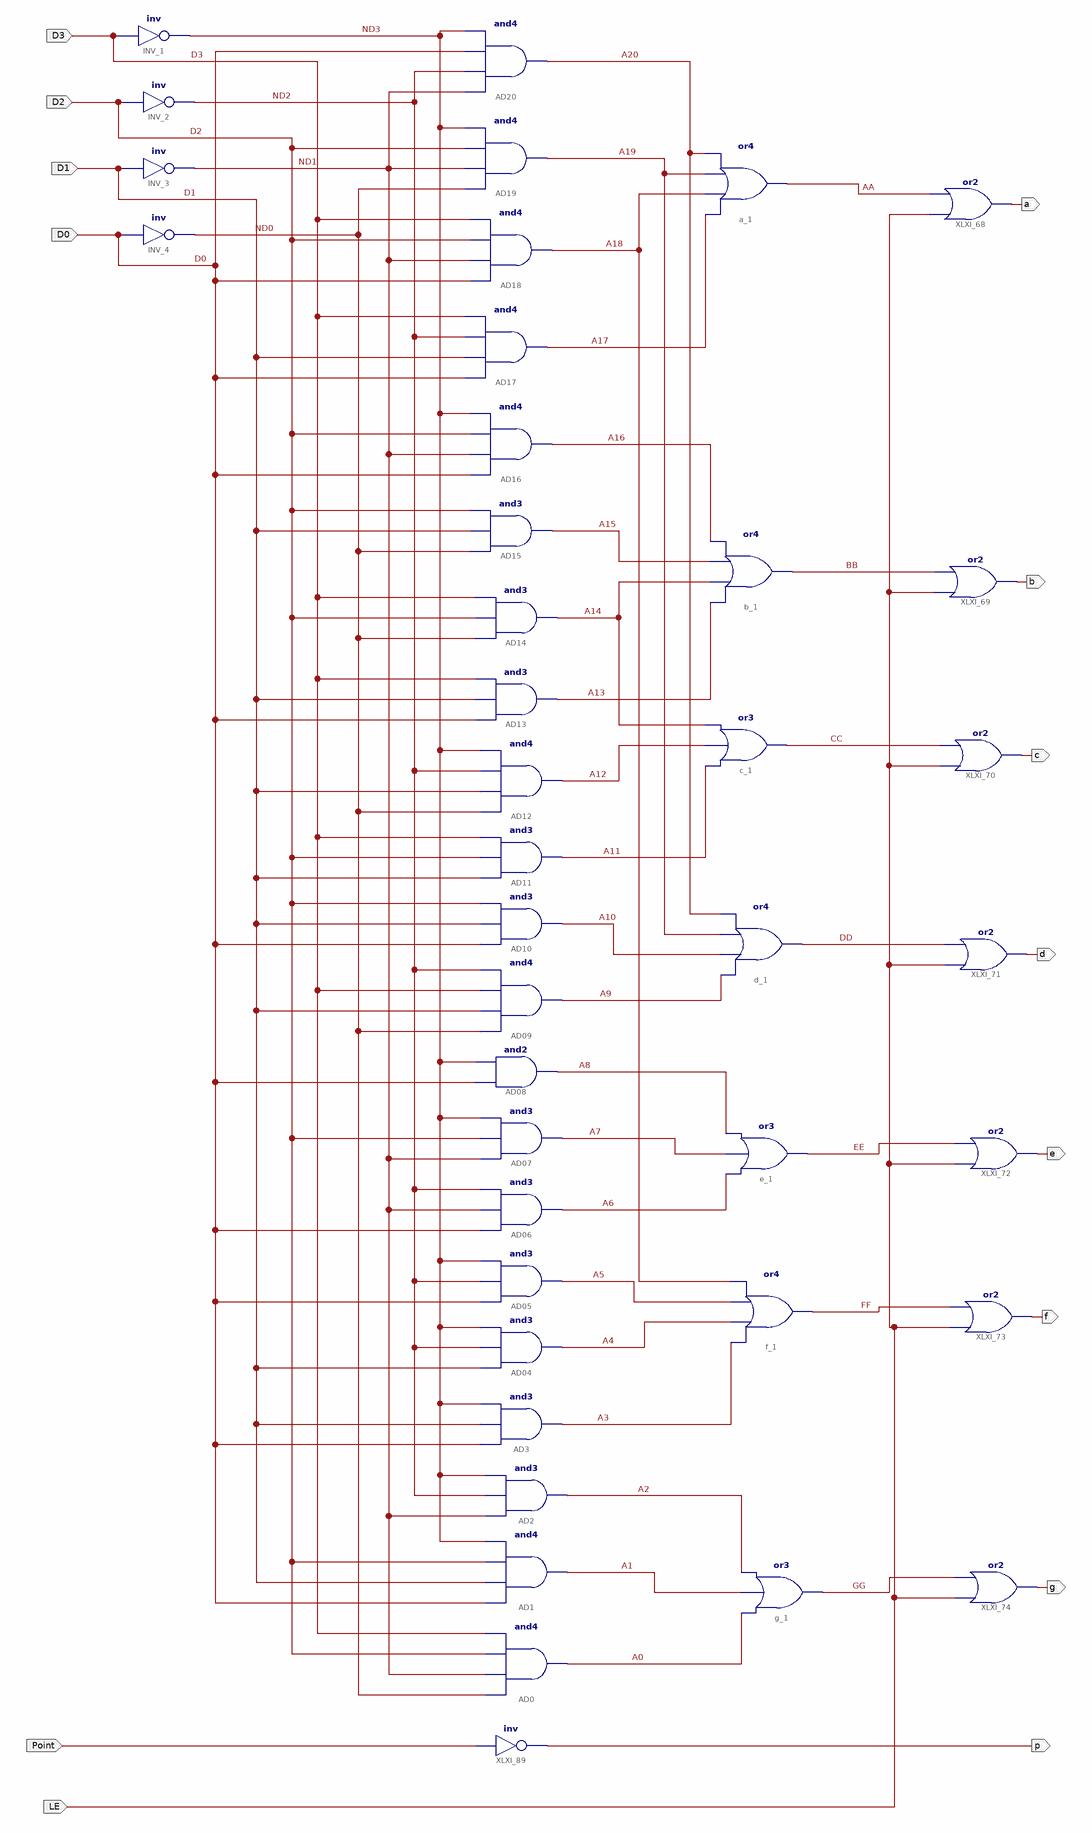
[diagram p0: schematic sheet 1]
// Xilinx ISE schematic MC14495_ZJU.sch (kintex7) as structural Verilog: 40 symbols, 14 ports
module MC14495_ZJU (
  input  D3,
  input  D2,
  input  D1,
  input  D0,
  input  Point,
  input  LE,
  output a,
  output b,
  output c,
  output d,
  output e,
  output f,
  output g,
  output p
);

  wire A0, A1, A2, A3, A4, A5, A6, A7, A8, A9, A10, A11, A12, A13, A14, A15, A16, A17, A18, A19, A20, AA, BB,
       CC, DD, EE, FF, GG, ND0, ND1, ND2, ND3;

  not INV_1 (ND3, D3);
  not INV_2 (ND2, D2);
  not INV_3 (ND1, D1);
  not INV_4 (ND0, D0);
  and AD20 (A20, ND1, ND2, D0, ND3);
  and AD18 (A18, D0, ND1, D2, D3);
  and AD17 (A17, D0, D1, ND2, D3);
  and AD16 (A16, D0, ND1, D2, ND3);
  and AD15 (A15, ND0, D1, D2);
  and AD14 (A14, ND0, D2, D3);
  and AD13 (A13, D0, D1, D3);
  and AD19 (A19, ND0, ND1, D2, ND3);
  and AD12 (A12, ND0, D1, ND2, ND3);
  and AD11 (A11, D1, D2, D3);
  and AD10 (A10, D0, D1, D2);
  and AD09 (A9, ND0, D1, D3, ND2);
  and AD07 (A7, ND1, D2, ND3);
  and AD06 (A6, D0, ND1, ND2);
  and AD04 (A4, D1, ND2, ND3);
  and AD05 (A5, D0, ND2, ND3);
  and AD3 (A3, D0, D1, ND3);
  and AD2 (A2, ND1, ND2, ND3);
  and AD1 (A1, D0, D1, D2, ND3);
  and AD0 (A0, ND0, ND1, D2, D3);
  and AD08 (A8, D0, ND3);
  or b_1 (BB, A13, A14, A15, A16);
  or c_1 (CC, A11, A12, A14);
  or d_1 (DD, A9, A10, A19, A20);
  or g_1 (GG, A0, A1, A2);
  or f_1 (FF, A3, A4, A5, A18);
  or a_1 (AA, A17, A18, A19, A20);
  or e_1 (EE, A6, A7, A8);
  or XLXI_69 (b, LE, BB);
  or XLXI_71 (d, LE, DD);
  or XLXI_72 (e, LE, EE);
  or XLXI_73 (f, LE, FF);
  or XLXI_74 (g, LE, GG);
  not XLXI_89 (p, Point);
  or XLXI_68 (a, LE, AA);
  or XLXI_70 (c, LE, CC);
endmodule
